# Altium schematic sheet Power Supply.SchDoc (part 2 of 5)
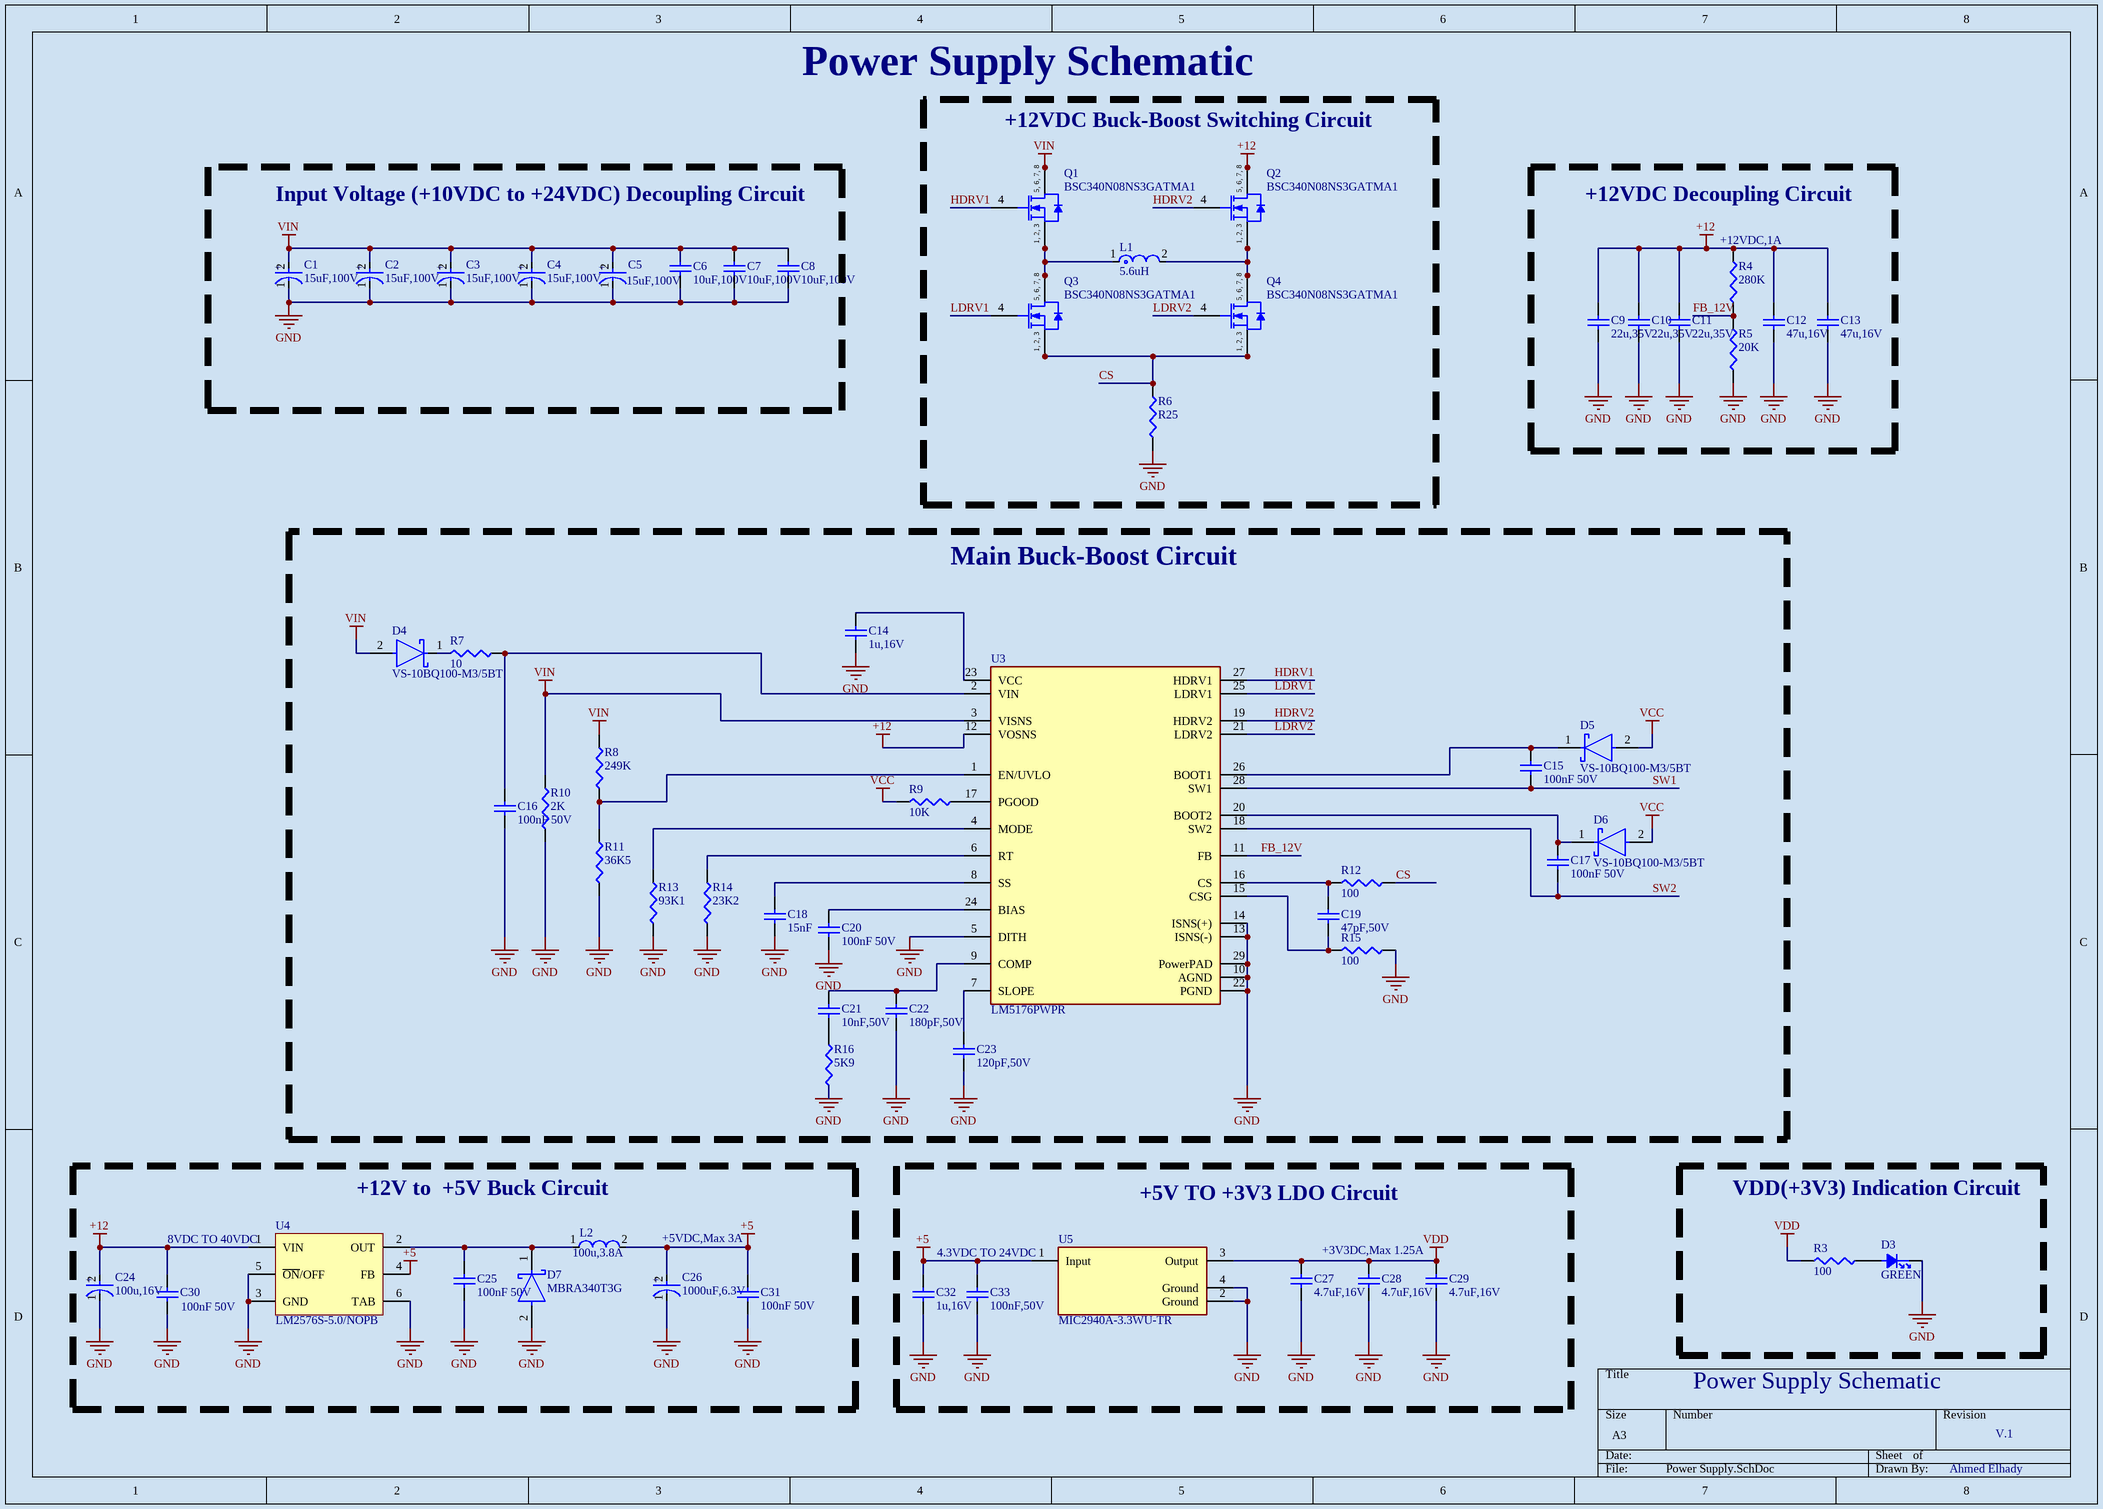
[diagram p1: Power Supply.SchDoc]
## Library data of the parts
C1-C5 = 100SXV15M: 15 µF 100 V Aluminum - Polymer Capacitors Radial, Can - SMD 40mOhm 1000 Hrs @ 125°C; Manufacturer: Panasonic; Value: 15µF; ESR (Equivalent Series Resistance): 40mΩ; Leakage Current: 75µA; Life (Hours): 1000hours; Polarity: Polar; Ripple Current: 36.5mA; Tolerance: 20%; Supplier: DigiKey; Manufacturer Part Number: 100SXV15M; RoHS: Compliant; Category: Aluminum Electrolytic Capacitors; Pricing: 1=3.23, 10=2.172, 50=1.7306, 100=1.5916 (USD); Case/Package: Radial; Diameter: 8mm; Height: 11.9mm; Height - Seated (Max): 11.9888mm; Length: 8.3mm; Lifecycle Status: Production; Material: Polymer; Max Operating Temperature: 125°C; Min Operating Temperature: -55°C; Mounting Technology: Surface Mount; Number of Terminals: 2; REACH SVHC: Yes; Schedule B: 8532220020, 8532220020|8532220020|8532220020|8532220020|8532220020|8532220020|8532220020|8532220020|8532220020|8532220020|8532220020|8532220020|8532220020|8532220020|8532220020|8532220020|8532220020|8532220020|8532220020|8532220020|8532220020|8532220020|8532220020|85; Voltage Rating: 100V; Voltage Rating (DC): 100V; Width: 8.3mm; ComponentLink1URL: https://datasheet.octopart.com:443/100SXV15M-Panasonic-datasheet-182100634.pdf?src-supplier=IHS; ComponentLink1Description: https://datasheet.octopart.com:443/100SXV15M-Panasonic-datasheet-182100634.pdf?src-supplier=IHS; ComponentLink2URL: https://sigma.octopart.com:443/138897373/technical_drawing/Panasonic-100SXV15M.pdf?src-supplier=Upverter; ComponentLink2Description: https://sigma.octopart.com:443/138897373/technical_drawing/Panasonic-100SXV15M.pdf?src-supplier=Upverter; ComponentLink3URL: https://datasheet.octopart.com:443/100SXV15M-Panasonic-datasheet-136807604.pdf?src-supplier=Master+Electronics; ComponentLink3Description: https://datasheet.octopart.com:443/100SXV15M-Panasonic-datasheet-136807604.pdf?src-supplier=Master+Electronics; ComponentLink4URL: https://datasheet.octopart.com:443/100SXV15M-Panasonic-datasheet-137287090.pdf?src-supplier=Master+Electronics; ComponentLink4Description: https://datasheet.octopart.com:443/100SXV15M-Panasonic-datasheet-137287090.pdf?src-supplier=Master+Electronics; ComponentLink5URL: https://datasheet.octopart.com:443/100SXV15M-Panasonic-datasheet-98225043.pdf?src-supplier=Farnell; ComponentLink5Description: https://datasheet.octopart.com:443/100SXV15M-Panasonic-datasheet-98225043.pdf?src-supplier=Farnell; ComponentLink6URL: https://datasheet.octopart.com:443/100SXV15M-Panasonic-datasheet-46913357.pdf?src-supplier=Newark; ComponentLink6Description: https://datasheet.octopart.com:443/100SXV15M-Panasonic-datasheet-46913357.pdf?src-supplier=Newark; ComponentLink7URL: https://datasheet.octopart.com:443/100SXV15M-Panasonic-datasheet-84207363.pdf?src-supplier=Panasonic+SCT; ComponentLink7Description: https://datasheet.octopart.com:443/100SXV15M-Panasonic-datasheet-84207363.pdf?src-supplier=Panasonic+SCT; ComponentLink8URL: https://sigma.octopart.com:443/150570690/technical_drawing/Panasonic-100SXV15M.pdf?src-supplier=Panasonic+SCT; ComponentLink8Description: https://sigma.octopart.com:443/150570690/technical_drawing/Panasonic-100SXV15M.pdf?src-supplier=Panasonic+SCT; ComponentLink9URL: https://datasheet.octopart.com:443/100SXV15M-Panasonic-datasheet-78862147.pdf?src-supplier=element14+APAC; ComponentLink9Description: https://datasheet.octopart.com:443/100SXV15M-Panasonic-datasheet-78862147.pdf?src-supplier=element14+APAC; LCSC PN: C542593
C6-C8 = C3225X7R2A106K250AC: 10 µF ±10% 100V Ceramic Capacitor X7R 1210 (3225 Metric); Manufacturer: TDK; Manufacturer Lifecycle Status: PRODUCTION; Value: 10µF; Supplier: DigiKey; Manufacturer Part Number: C3225X7R2A106K250AC; RoHS: Compliant; Category: Ceramic Capacitors; Stock: 64436; Pricing: 1=1.48, 10=0.943, 50=0.7756, 100=0.7141, 500=0.6104 (USD); Case/Package: 1210; China RoHS: Compliant; Dielectric Material: Ceramic; Height: 2.5mm; Length: 3.2mm; Lifecycle Status: Production; Material: Ceramic; Max Length: 3.65mm; Max Operating Temperature: 125°C; Max Width: 2.85mm; Min Length: 2.8mm; Min Operating Temperature: -55°C; Min Width: 2.2mm; Mounting Technology: Surface Mount; Number of Terminals: 2; REACH SVHC: Yes; Tolerance: 10%; Voltage Rating: 100V; Voltage Rating (DC): 100V; Width: 2.5mm; ComponentLink1URL: https://datasheet.octopart.com:443/C3225X7R2A106K250AC-TDK-datasheet-182135092.pdf?src-supplier=IHS; ComponentLink1Description: https://datasheet.octopart.com:443/C3225X7R2A106K250AC-TDK-datasheet-182135092.pdf?src-supplier=IHS; ComponentLink2URL: https://datasheet.octopart.com:443/C3225X7R2A106K250AC-TDK-datasheet-151546522.pdf?src-supplier=Future+Electronics; ComponentLink2Description: https://datasheet.octopart.com:443/C3225X7R2A106K250AC-TDK-datasheet-151546522.pdf?src-supplier=Future+Electronics; ComponentLink3URL: https://datasheet.octopart.com:443/C3225X7R2A106K250AC-TDK-datasheet-151546523.pdf?src-supplier=ODG+(Origin+Data+Global); ComponentLink3Description: https://datasheet.octopart.com:443/C3225X7R2A106K250AC-TDK-datasheet-151546523.pdf?src-supplier=ODG+(Origin+Data+Global); LCSC PN: C3883958
C9-C11 = C2012X5R1V226M125AC: 22 µF ±20% 35V Ceramic Capacitor X5R 0805 (2012 Metric); Manufacturer: TDK; Manufacturer Lifecycle Status: PRODUCTION; Value: 22µF; Supplier: DigiKey; Manufacturer Part Number: C2012X5R1V226M125AC; RoHS: Compliant; Category: Ceramic Capacitors; Stock: 844067; Pricing: 1=0.57, 10=0.349, 50=0.263, 100=0.2367, 500=0.1923, 1000=0.17857 (USD); Case/Package: 0805; Case Code (Imperial): 0805; Case Code (Metric): 2012; China RoHS: Compliant; Dielectric: X5R; Dielectric Material: Ceramic; Height: 1.25mm; Lead Free: Lead Free; Length: 2mm; Lifecycle Status: Production; Material: Ceramic; Max Length: 2.2mm; Max Operating Temperature: 85°C; Max Width: 1.45mm; Min Length: 1.8mm; Min Operating Temperature: -55°C; Min Width: 1.05mm; Mounting Technology: Surface Mount; Number of Terminals: 2; REACH SVHC: Yes; Schedule B: 8532240020, 8532240020|8532240020|8532240020|8532240020|8532240020; Termination: SMD/SMT; Tolerance: 20%; Voltage Rating: 35V; Voltage Rating (DC): 35V; Weight: 5.499807mg; Width: 1.25mm; ComponentLink1URL: https://datasheet.octopart.com:443/C2012X5R1V226M125AC-TDK-datasheet-175423548.pdf?src-supplier=TME; ComponentLink1Description: https://datasheet.octopart.com:443/C2012X5R1V226M125AC-TDK-datasheet-175423548.pdf?src-supplier=TME; ComponentLink2URL: https://datasheet.octopart.com:443/C2012X5R1V226M125AC-TDK-datasheet-182135025.pdf?src-supplier=TME; ComponentLink2Description: https://datasheet.octopart.com:443/C2012X5R1V226M125AC-TDK-datasheet-182135025.pdf?src-supplier=TME; ComponentLink3URL: https://datasheet.octopart.com:443/C2012X5R1V226M125AC-TDK-datasheet-159617022.pdf?src-supplier=TME; ComponentLink3Description: https://datasheet.octopart.com:443/C2012X5R1V226M125AC-TDK-datasheet-159617022.pdf?src-supplier=TME; ComponentLink4URL: https://datasheet.octopart.com:443/C2012X5R1V226M125AC-TDK-datasheet-68298673.pdf?src-supplier=Upverter; ComponentLink4Description: https://datasheet.octopart.com:443/C2012X5R1V226M125AC-TDK-datasheet-68298673.pdf?src-supplier=Upverter; ComponentLink5URL: https://datasheet.octopart.com:443/C2012X5R1V226M125AC-TDK-datasheet-151546523.pdf?src-supplier=ODG+(Origin+Data+Global); ComponentLink5Description: https://datasheet.octopart.com:443/C2012X5R1V226M125AC-TDK-datasheet-151546523.pdf?src-supplier=ODG+(Origin+Data+Global); ComponentLink6URL: https://datasheet.octopart.com:443/C2012X5R1V226M125AC-TDK-datasheet-82475248.pdf?src-supplier=Newark; ComponentLink6Description: https://datasheet.octopart.com:443/C2012X5R1V226M125AC-TDK-datasheet-82475248.pdf?src-supplier=Newark; ComponentLink7URL: https://datasheet.octopart.com/C2012X5R1V226M125AC-TDK-datasheet-41194876.pdf; ComponentLink7Description: https://datasheet.octopart.com/C2012X5R1V226M125AC-TDK-datasheet-41194876.pdf; ComponentLink8URL: https://datasheet.octopart.com/C-Series-Ceramic-Chip-Capacitors-TDK-datasheet-family-84.pdf; ComponentLink8Description: https://datasheet.octopart.com/C-Series-Ceramic-Chip-Capacitors-TDK-datasheet-family-84.pdf; ComponentLink9URL: https://datasheet.octopart.com:443/C2012X5R1V226M125AC-TDK-datasheet-158983655.pdf?src-supplier=Farnell; ComponentLink9Description: https://datasheet.octopart.com:443/C2012X5R1V226M125AC-TDK-datasheet-158983655.pdf?src-supplier=Farnell; ComponentLink10URL: https://datasheet.octopart.com:443/C2012X5R1V226M125AC-TDK-datasheet-25352837.pdf?src-supplier=Future+Electronics; ComponentLink10Description: https://datasheet.octopart.com:443/C2012X5R1V226M125AC-TDK-datasheet-25352837.pdf?src-supplier=Future+Electronics; ComponentLink11URL: https://datasheet.octopart.com:443/C2012X5R1V226M125AC-TDK-datasheet-23766614.pdf?src-supplier=Future+Electronics; ComponentLink11Description: https://datasheet.octopart.com:443/C2012X5R1V226M125AC-TDK-datasheet-23766614.pdf?src-supplier=Future+Electronics; ComponentLink12URL: http://sigma.octopart.com:80/rohs_certificate/C-Series-Ceramic-Chip-Capacitors-TDK-family-108.pdf?src-supplier=Compliance+Statements; ComponentLink12Description: http://sigma.octopart.com:80/rohs_certificate/C-Series-Ceramic-Chip-Capacitors-TDK-family-108.pdf?src-supplier=Compliance+Statements; LCSC PN: C2179409
C12 C13 = GRM32ER61C476KE15L: 47 µF ±10% 16V Ceramic Capacitor X5R 1210 (3225 Metric); Manufacturer: Murata; Manufacturer Lifecycle Status: NRND; Value: 47µF; Supplier: DigiKey; Manufacturer Part Number: GRM32ER61C476KE15L; RoHS: Compliant; Category: Ceramic Capacitors; Stock: 76946; Pricing: 1=1.23, 10=0.798, 50=0.6284, 100=0.5762, 500=0.48794, 1000=0.46985, 2000=0.44694, 3000=0.43546, 5000=0.42273, 7000=0.41529, 10000=0.40814, 12000=0.40475, 24000=0.39332, 25000=0.39272 (USD); Case/Package: 1210; Case Code (Imperial): 1210; Case Code (Metric): 3225; Depth: 2.5mm; Dielectric: X5R; Dielectric Material: Ceramic; Height: 2.5mm; Lead Free: Lead Free; Length: 3.2mm; Lifecycle Status: NRND; Material: Ceramic; Max Operating Temperature: 85°C; Min Operating Temperature: -55°C; Mounting Technology: Surface Mount; Pins: 2; Number of Terminals: 2; Radiation Hardening: No; REACH SVHC: Yes; Schedule B: 8532240020, 8532240020|8532240020, 8532240020|8532240020|8532240020, 8532240020|8532240020|8532240020|8532240020; Termination: SMD/SMT; Thickness: 2.5mm; Tolerance: 10%; Voltage: 16V; Voltage Rating: 16V; Voltage Rating (DC): 16V; Width: 2.5mm; ComponentLink1URL: https://datasheet.octopart.com:443/GRM32ER61C476KE15L-Murata-datasheet-11893327.pdf?src-supplier=_legacy+Avnet; ComponentLink1Description: https://datasheet.octopart.com:443/GRM32ER61C476KE15L-Murata-datasheet-11893327.pdf?src-supplier=_legacy+Avnet; ComponentLink2URL: https://datasheet.octopart.com:443/GRM32ER61C476KE15L-Murata-datasheet-62317406.pdf?src-supplier=element14+APAC; ComponentLink2Description: https://datasheet.octopart.com:443/GRM32ER61C476KE15L-Murata-datasheet-62317406.pdf?src-supplier=element14+APAC; ComponentLink3URL: https://datasheet.octopart.com:443/GRM32ER61C476KE15L-Murata-datasheet-17853190.pdf?src-supplier=element14+APAC; ComponentLink3Description: https://datasheet.octopart.com:443/GRM32ER61C476KE15L-Murata-datasheet-17853190.pdf?src-supplier=element14+APAC; ComponentLink4URL: https://datasheet.octopart.com:443/GRM32ER61C476KE15L-Murata-datasheet-8817987.pdf?src-supplier=Newark; ComponentLink4Description: https://datasheet.octopart.com:443/GRM32ER61C476KE15L-Murata-datasheet-8817987.pdf?src-supplier=Newark; ComponentLink5URL: https://datasheet.octopart.com:443/GRM32ER61C476KE15L-Murata-datasheet-14403028.pdf?src-supplier=Future+Electronics; ComponentLink5Description: https://datasheet.octopart.com:443/GRM32ER61C476KE15L-Murata-datasheet-14403028.pdf?src-supplier=Future+Electronics; ComponentLink6URL: https://datasheet.octopart.com:443/GRM32ER61C476KE15L-Murata-datasheet-22122223.pdf?src-supplier=Future+Electronics; ComponentLink6Description: https://datasheet.octopart.com:443/GRM32ER61C476KE15L-Murata-datasheet-22122223.pdf?src-supplier=Future+Electronics; ComponentLink7URL: https://datasheet.octopart.com:443/GRM32ER61C476KE15L-Murata-datasheet-44109711.pdf?src-supplier=Future+Electronics; ComponentLink7Description: https://datasheet.octopart.com:443/GRM32ER61C476KE15L-Murata-datasheet-44109711.pdf?src-supplier=Future+Electronics; ComponentLink8URL: https://datasheet.octopart.com:443/GRM32ER61C476KE15L-Murata-datasheet-165579666.pdf?src-supplier=TME; ComponentLink8Description: https://datasheet.octopart.com:443/GRM32ER61C476KE15L-Murata-datasheet-165579666.pdf?src-supplier=TME; ComponentLink9URL: https://datasheet.octopart.com:443/GRM32ER61C476KE15L-Murata-datasheet-59876780.pdf?src-supplier=TME; ComponentLink9Description: https://datasheet.octopart.com:443/GRM32ER61C476KE15L-Murata-datasheet-59876780.pdf?src-supplier=TME; ComponentLink10URL: https://datasheet.octopart.com:443/GRM32ER61C476KE15L-Murata-datasheet-140709622.pdf?src-supplier=Ciiva; ComponentLink10Description: https://datasheet.octopart.com:443/GRM32ER61C476KE15L-Murata-datasheet-140709622.pdf?src-supplier=Ciiva; ComponentLink11URL: https://datasheet.octopart.com:443/GRM32ER61C476KE15L-Murata-datasheet-138747025.pdf?src-supplier=Ciiva; ComponentLink11Description: https://datasheet.octopart.com:443/GRM32ER61C476KE15L-Murata-datasheet-138747025.pdf?src-supplier=Ciiva; ComponentLink12URL: https://datasheet.octopart.com:443/GRM32ER61C476KE15L-Murata-datasheet-14047368.pdf?src-supplier=iiiC; ComponentLink12Description: https://datasheet.octopart.com:443/GRM32ER61C476KE15L-Murata-datasheet-14047368.pdf?src-supplier=iiiC; ComponentLink13URL: https://datasheet.octopart.com/GRM32ER61C476KE15L-Murata-datasheet-12515295.pdf; ComponentLink13Description: https://datasheet.octopart.com/GRM32ER61C476KE15L-Murata-datasheet-12515295.pdf; ComponentLink14URL: https://datasheet.octopart.com/GRM32ER61C476KE15L-Murata-datasheet-12510076.pdf; ComponentLink14Description: https://datasheet.octopart.com/GRM32ER61C476KE15L-Murata-datasheet-12510076.pdf; ComponentLink15URL: https://datasheet.octopart.com/GRM32ER61C476KE15L-Murata-datasheet-11978611.pdf; ComponentLink15Description: https://datasheet.octopart.com/GRM32ER61C476KE15L-Murata-datasheet-11978611.pdf; ComponentLink16URL: https://datasheet.octopart.com/GRM32ER61C476KE15L-Murata-datasheet-10025737.pdf; ComponentLink16Description: https://datasheet.octopart.com/GRM32ER61C476KE15L-Murata-datasheet-10025737.pdf; ComponentLink17URL: https://datasheet.octopart.com/GRM32ER61C476KE15L-Murata-datasheet-8819587.pdf; ComponentLink17Description: https://datasheet.octopart.com/GRM32ER61C476KE15L-Murata-datasheet-8819587.pdf; ComponentLink18URL: https://datasheet.octopart.com:443/GRM32ER61C476KE15L.-Murata-datasheet-5332913.pdf?src-supplier=Farnell; ComponentLink18Description: https://datasheet.octopart.com:443/GRM32ER61C476KE15L.-Murata-datasheet-5332913.pdf?src-supplier=Farnell; ComponentLink19URL: http://sigma.octopart.com:80/reach_statement/Murata-company-16.pdf?src-supplier=Compliance+Statements; ComponentLink19Description: http://sigma.octopart.com:80/reach_statement/Murata-company-16.pdf?src-supplier=Compliance+Statements; LCSC PN: C77101
C14 C32 = EMK107B7105KA-T: 1 µF ±10% 16V Ceramic Capacitor X7R 0603 (1608 Metric); Manufacturer: Taiyo Yuden; Value: 1µF; Supplier: DigiKey; Manufacturer Part Number: EMK107B7105KA-T; RoHS: Compliant; Category: Ceramic Capacitors; Stock: 1003655; Pricing: 1=0.08, 10=0.013, 50=0.0116, 100=0.0104, 500=0.00964 (USD); Case/Package: 0603; Case Code (Imperial): 0603; Case Code (Metric): 1608; China RoHS: Compliant; Composition: Ceramic; Contact Plating: Nickel; Depth: 800µm; Dielectric: X7R; Dielectric Material: Ceramic; Halogen Free: Halogen Free; Height: 800µm; Lead Free: Lead Free; Length: 1.6mm; Lifecycle Status: Production; Material: Ceramic; Max Length: 1.7mm; Max Operating Temperature: 125°C; Max Thickness: 900µm; Max Width: 900µm; Min Length: 1.5mm; Min Operating Temperature: -55°C; Min Thickness: 700µm; Min Width: 700µm; Mounting Technology: Surface Mount; Pins: 2; Number of Terminals: 2; Packaging: Cut Tape; Radiation Hardening: No; REACH SVHC: Yes; Termination: SMD/SMT; Thickness: 889µm; Tolerance: 10%; Voltage Rating: 16V; Voltage Rating (DC): 16V; Width: 800µm; ComponentLink1URL: https://datasheet.octopart.com:443/EMK107B7105KA-T-Taiyo-Yuden-datasheet-182102775.pdf?src-supplier=IHS; ComponentLink1Description: https://datasheet.octopart.com:443/EMK107B7105KA-T-Taiyo-Yuden-datasheet-182102775.pdf?src-supplier=IHS; ComponentLink2URL: https://datasheet.octopart.com:443/EMK107B7105KA-T-Taiyo-Yuden-datasheet-8857305.pdf?src-supplier=Master+Electronics; ComponentLink2Description: https://datasheet.octopart.com:443/EMK107B7105KA-T-Taiyo-Yuden-datasheet-8857305.pdf?src-supplier=Master+Electronics; ComponentLink3URL: https://datasheet.octopart.com:443/EMK107B7105KA-T-Taiyo-Yuden-datasheet-154807686.pdf?src-supplier=Master+Electronics; ComponentLink3Description: https://datasheet.octopart.com:443/EMK107B7105KA-T-Taiyo-Yuden-datasheet-154807686.pdf?src-supplier=Master+Electronics; ComponentLink4URL: https://datasheet.octopart.com:443/EMK107B7105KA-T-Taiyo-Yuden-datasheet-140424376.pdf?src-supplier=Master+Electronics; ComponentLink4Description: https://datasheet.octopart.com:443/EMK107B7105KA-T-Taiyo-Yuden-datasheet-140424376.pdf?src-supplier=Master+Electronics; ComponentLink5URL: https://datasheet.octopart.com:443/EMK107B7105KA-T-Taiyo-Yuden-datasheet-151625811.pdf?src-supplier=Farnell; ComponentLink5Description: https://datasheet.octopart.com:443/EMK107B7105KA-T-Taiyo-Yuden-datasheet-151625811.pdf?src-supplier=Farnell; ComponentLink6URL: https://datasheet.octopart.com:443/EMK107B7105KA-T-Taiyo-Yuden-datasheet-65850851.pdf?src-supplier=Newark; ComponentLink6Description: https://datasheet.octopart.com:443/EMK107B7105KA-T-Taiyo-Yuden-datasheet-65850851.pdf?src-supplier=Newark; ComponentLink7URL: https://datasheet.octopart.com:443/EMK107B7105KA-T-Taiyo-Yuden-datasheet-14717454.pdf?src-supplier=Newark; ComponentLink7Description: https://datasheet.octopart.com:443/EMK107B7105KA-T-Taiyo-Yuden-datasheet-14717454.pdf?src-supplier=Newark; ComponentLink8URL: https://datasheet.octopart.com:443/EMK107B7105KA-T-Taiyo-Yuden-datasheet-138738940.pdf?src-supplier=Taiyo+Yuden+SCT; ComponentLink8Description: https://datasheet.octopart.com:443/EMK107B7105KA-T-Taiyo-Yuden-datasheet-138738940.pdf?src-supplier=Taiyo+Yuden+SCT; ComponentLink9URL: https://datasheet.octopart.com:443/EMK107B7105KA-T-Taiyo-Yuden-datasheet-99784766.pdf?src-supplier=Future+Electronics; ComponentLink9Description: https://datasheet.octopart.com:443/EMK107B7105KA-T-Taiyo-Yuden-datasheet-99784766.pdf?src-supplier=Future+Electronics; ComponentLink10URL: https://datasheet.octopart.com:443/EMK107B7105KA-T-Taiyo-Yuden-datasheet-99833418.pdf?src-supplier=Future+Electronics; ComponentLink10Description: https://datasheet.octopart.com:443/EMK107B7105KA-T-Taiyo-Yuden-datasheet-99833418.pdf?src-supplier=Future+Electronics; ComponentLink11URL: https://datasheet.octopart.com:443/CEEMK107B7105KA-T-Taiyo-Yuden-datasheet-62282700.pdf?src-supplier=Electro+Sonic; ComponentLink11Description: https://datasheet.octopart.com:443/CEEMK107B7105KA-T-Taiyo-Yuden-datasheet-62282700.pdf?src-supplier=Electro+Sonic; ComponentLink12URL: https://datasheet.octopart.com:443/EMK107B7105KA-T-Taiyo-Yuden-datasheet-62109223.pdf?src-supplier=Electro+Sonic; ComponentLink12Description: https://datasheet.octopart.com:443/EMK107B7105KA-T-Taiyo-Yuden-datasheet-62109223.pdf?src-supplier=Electro+Sonic; ComponentLink13URL: https://datasheet.octopart.com:443/EMK107B7105KA-T-Taiyo-Yuden-datasheet-41181424.pdf?src-supplier=Electro+Sonic; ComponentLink13Description: https://datasheet.octopart.com:443/EMK107B7105KA-T-Taiyo-Yuden-datasheet-41181424.pdf?src-supplier=Electro+Sonic; ComponentLink14URL: https://datasheet.octopart.com/EMK107B7105KA-T-Taiyo-Yuden-datasheet-17272276.pdf; ComponentLink14Description: https://datasheet.octopart.com/EMK107B7105KA-T-Taiyo-Yuden-datasheet-17272276.pdf; ComponentLink15URL: https://datasheet.octopart.com:443/EMK107B7105KA-T-Taiyo-Yuden-datasheet-13693549.pdf?src-supplier=_legacy+Avnet; ComponentLink15Description: https://datasheet.octopart.com:443/EMK107B7105KA-T-Taiyo-Yuden-datasheet-13693549.pdf?src-supplier=_legacy+Avnet; ComponentLink16URL: https://datasheet.octopart.com:443/EMK107B7105KA-T-Taiyo-Yuden-datasheet-10851928.pdf?src-supplier=element14; ComponentLink16Description: https://datasheet.octopart.com:443/EMK107B7105KA-T-Taiyo-Yuden-datasheet-10851928.pdf?src-supplier=element14; ComponentLink17URL: https://datasheet.octopart.com:443/EMK107B7105KA-T-Taiyo-Yuden-datasheet-8434558.pdf?src-supplier=element14; ComponentLink17Description: https://datasheet.octopart.com:443/EMK107B7105KA-T-Taiyo-Yuden-datasheet-8434558.pdf?src-supplier=element14; ComponentLink18URL: https://datasheet.octopart.com:443/EMK107B7105KA-T-Taiyo-Yuden-datasheet-10742123.pdf?src-supplier=Factory+Futures; ComponentLink18Description: https://datasheet.octopart.com:443/EMK107B7105KA-T-Taiyo-Yuden-datasheet-10742123.pdf?src-supplier=Factory+Futures; LCSC PN: C92759
C15-C17 C20 C25 C30 C31 C33 = CGA3E2X7R1H104K080AA: 0.1 µF ±10% 50V Ceramic Capacitor X7R 0603 (1608 Metric); Manufacturer: TDK; Manufacturer Lifecycle Status: PRODUCTION; Supplier: DigiKey; Manufacturer Part Number: CGA3E2X7R1H104K080AA; RoHS: Compliant; Category: Ceramic Capacitors; Stock: 973492; Pricing: 1=0.1, 10=0.044, 50=0.0302, 100=0.026, 500=0.01886, 1000=0.01666 (USD); Value: 100nF; Case/Package: 0603; Case Code (Imperial): 0603; Case Code (Metric): 1608; China RoHS: Compliant; Composition: Ceramic; Depth: 800µm; Dielectric: X7R; Dielectric Material: Ceramic; Height: 800µm; Lead Free: Lead Free; Length: 1.6mm; Lifecycle Status: Production; Material: Ceramic; Max Length: 1.7mm; Max Operating Temperature: 125°C; Max Width: 900µm; Min Length: 1.5mm; Min Operating Temperature: -55°C; Min Width: 700µm; Mounting Technology: Surface Mount; Number of Terminals: 2; Radiation Hardening: No; Ratings: AEC-Q200; REACH SVHC: Yes; Schedule B: 8532240020, 8532240020|8532240020|8532240020|8532240020|8532240020; Termination: SMD/SMT; Thickness: 889µm; Tolerance: 10%; Voltage: 50V; Voltage Rating: 50V; Voltage Rating (DC): 50V; Weight: 2.012816mg; Width: 800µm; ComponentLink1URL: https://datasheet.octopart.com:443/CGA3E2X7R1H104K080AA-TDK-datasheet-165583812.pdf?src-supplier=IHS; ComponentLink1Description: https://datasheet.octopart.com:443/CGA3E2X7R1H104K080AA-TDK-datasheet-165583812.pdf?src-supplier=IHS; ComponentLink2URL: https://datasheet.octopart.com:443/CGA3E2X7R1H104K080AA-TDK-datasheet-138890726.pdf?src-supplier=Upverter; ComponentLink2Description: https://datasheet.octopart.com:443/CGA3E2X7R1H104K080AA-TDK-datasheet-138890726.pdf?src-supplier=Upverter; ComponentLink3URL: https://datasheet.octopart.com:443/CGA3E2X7R1H104K080AA-TDK-datasheet-43457115.pdf?src-supplier=Upverter; ComponentLink3Description: https://datasheet.octopart.com:443/CGA3E2X7R1H104K080AA-TDK-datasheet-43457115.pdf?src-supplier=Upverter; ComponentLink4URL: https://datasheet.octopart.com:443/CGA3E2X7R1H104K080AA-TDK-datasheet-151546526.pdf?src-supplier=ODG+(Origin+Data+Global); ComponentLink4Description: https://datasheet.octopart.com:443/CGA3E2X7R1H104K080AA-TDK-datasheet-151546526.pdf?src-supplier=ODG+(Origin+Data+Global); ComponentLink5URL: https://datasheet.octopart.com:443/CGA3E2X7R1H104K080AA-TDK-datasheet-43366117.pdf?src-supplier=Newark; ComponentLink5Description: https://datasheet.octopart.com:443/CGA3E2X7R1H104K080AA-TDK-datasheet-43366117.pdf?src-supplier=Newark; ComponentLink6URL: https://datasheet.octopart.com:443/CGA3E2X7R1H104K080AA-TDK-datasheet-23766614.pdf?src-supplier=Newark; ComponentLink6Description: https://datasheet.octopart.com:443/CGA3E2X7R1H104K080AA-TDK-datasheet-23766614.pdf?src-supplier=Newark; ComponentLink7URL: https://datasheet.octopart.com:443/CGA3E2X7R1H104K080AA-TDK-datasheet-13444418.pdf?src-supplier=Newark; ComponentLink7Description: https://datasheet.octopart.com:443/CGA3E2X7R1H104K080AA-TDK-datasheet-13444418.pdf?src-supplier=Newark; ComponentLink8URL: https://datasheet.octopart.com:443/CGA3E2X7R1H104K080AA.-TDK-datasheet-159510193.pdf?src-supplier=Newark; ComponentLink8Description: https://datasheet.octopart.com:443/CGA3E2X7R1H104K080AA.-TDK-datasheet-159510193.pdf?src-supplier=Newark; ComponentLink9URL: https://datasheet.octopart.com:443/CGA3E2X7R1H104K080AA-TDK-datasheet-136412745.pdf?src-supplier=element14+APAC; ComponentLink9Description: https://datasheet.octopart.com:443/CGA3E2X7R1H104K080AA-TDK-datasheet-136412745.pdf?src-supplier=element14+APAC; ComponentLink10URL: https://datasheet.octopart.com:443/CGA3E2X7R1H104K080AA-TDK-datasheet-21217900.pdf?src-supplier=Farnell; ComponentLink10Description: https://datasheet.octopart.com:443/CGA3E2X7R1H104K080AA-TDK-datasheet-21217900.pdf?src-supplier=Farnell; ComponentLink11URL: https://datasheet.octopart.com:443/CGA3E2X7R1H104K080AA-TDK-datasheet-164882302.pdf?src-supplier=Burklin+Elektronik; ComponentLink11Description: https://datasheet.octopart.com:443/CGA3E2X7R1H104K080AA-TDK-datasheet-164882302.pdf?src-supplier=Burklin+Elektronik; ComponentLink12URL: https://datasheet.octopart.com:443/CGA3E2X7R1H104K080AA-TDK-datasheet-13234200.pdf?src-supplier=Future+Electronics; ComponentLink12Description: https://datasheet.octopart.com:443/CGA3E2X7R1H104K080AA-TDK-datasheet-13234200.pdf?src-supplier=Future+Electronics; ComponentLink13URL: https://datasheet.octopart.com:443/CGA3E2X7R1H104K080AA-TDK-datasheet-12527010.pdf?src-supplier=Future+Electronics; ComponentLink13Description: https://datasheet.octopart.com:443/CGA3E2X7R1H104K080AA-TDK-datasheet-12527010.pdf?src-supplier=Future+Electronics; ComponentLink14URL: https://datasheet.octopart.com:443/CGA3E2X7R1H104K080AA-TDK-datasheet-140571036.pdf?src-supplier=Arrow.cn; ComponentLink14Description: https://datasheet.octopart.com:443/CGA3E2X7R1H104K080AA-TDK-datasheet-140571036.pdf?src-supplier=Arrow.cn; LCSC PN: C189228
C18 = C0603C153J3GACTU: 15nF ±5% 25V Ceramic Capacitor C0G, NP0 0603 (1608 Metric); Manufacturer: KEMET; Dissipation Factor: 0.1%; Temperature Coefficient: 30ppm/°C; Supplier: DigiKey; Manufacturer Part Number: C0603C153J3GACTU; RoHS: Compliant; Category: Ceramic Capacitors; Stock: 20065; Pricing: 1=0.37, 10=0.221, 50=0.163, 100=0.1376, 500=0.10484, 1000=0.0951 (USD); Value: 15nF; Case/Package: 0603; Case Code (Imperial): 0603; Case Code (Metric): 1608; China RoHS: Compliant; Contact Plating: Tin; Depth: 800µm; Dielectric: C0G; Dielectric Material: Ceramic; Height: 800µm; Lead Free: Lead Free; Length: 1.6mm; Lifecycle Status: Production; Material: Ceramic; Max Operating Temperature: 125°C; Min Operating Temperature: -55°C; Mounting Technology: Surface Mount; Pins: 2; Number of Terminals: 2; Packaging: Cut Tape; REACH SVHC: Yes; Schedule B: 8532240020, 8532240020|8532240020, 8532240020|8532240020|8532240020, 8532240020|8532240020|8532240020|8532240020; Termination: SMD/SMT; Thickness: 863.6µm; Tolerance: 5%; Voltage: 25V; Voltage Rating: 25V; Voltage Rating (DC): 25V; Width: 800µm; ComponentLink1URL: https://datasheet.octopart.com:443/C0603C153J3GACTU-KEMET-datasheet-178132257.pdf?src-supplier=IHS; ComponentLink1Description: https://datasheet.octopart.com:443/C0603C153J3GACTU-KEMET-datasheet-178132257.pdf?src-supplier=IHS; ComponentLink2URL: https://datasheet.octopart.com:443/C0603C153J3GAC7867-KEMET-datasheet-10540709.pdf?src-supplier=IHS; ComponentLink2Description: https://datasheet.octopart.com:443/C0603C153J3GAC7867-KEMET-datasheet-10540709.pdf?src-supplier=IHS; ComponentLink3URL: https://datasheet.octopart.com:443/C0603C153J3GACTU-KEMET-datasheet-137357764.pdf?src-supplier=Upverter; ComponentLink3Description: https://datasheet.octopart.com:443/C0603C153J3GACTU-KEMET-datasheet-137357764.pdf?src-supplier=Upverter; ComponentLink4URL: https://datasheet.octopart.com:443/C0603C153J3GACTU-KEMET-datasheet-68331921.pdf?src-supplier=Farnell; ComponentLink4Description: https://datasheet.octopart.com:443/C0603C153J3GACTU-KEMET-datasheet-68331921.pdf?src-supplier=Farnell; ComponentLink5URL: https://datasheet.octopart.com:443/C0603C153J3GACTU-KEMET-datasheet-102648314.pdf?src-supplier=Farnell; ComponentLink5Description: https://datasheet.octopart.com:443/C0603C153J3GACTU-KEMET-datasheet-102648314.pdf?src-supplier=Farnell; ComponentLink6URL: https://datasheet.octopart.com:443/C0603C153J3GACTU-Kemet-datasheet-5308203.pdf?src-supplier=Farnell; ComponentLink6Description: https://datasheet.octopart.com:443/C0603C153J3GACTU-Kemet-datasheet-5308203.pdf?src-supplier=Farnell; ComponentLink7URL: https://datasheet.octopart.com:443/C0603C153J3GACTU-KEMET-datasheet-176289261.pdf?src-supplier=element14+APAC; ComponentLink7Description: https://datasheet.octopart.com:443/C0603C153J3GACTU-KEMET-datasheet-176289261.pdf?src-supplier=element14+APAC; ComponentLink8URL: https://datasheet.octopart.com:443/C0603C153J3GACTU-KEMET-datasheet-178087916.pdf?src-supplier=element14+APAC; ComponentLink8Description: https://datasheet.octopart.com:443/C0603C153J3GACTU-KEMET-datasheet-178087916.pdf?src-supplier=element14+APAC; ComponentLink9URL: https://datasheet.octopart.com:443/C0603C153J3GACTU-Kemet-datasheet-66093294.pdf?src-supplier=element14+APAC; ComponentLink9Description: https://datasheet.octopart.com:443/C0603C153J3GACTU-Kemet-datasheet-66093294.pdf?src-supplier=element14+APAC; ComponentLink10URL: https://datasheet.octopart.com:443/C0603C153J3GACTU-Kemet-datasheet-66634713.pdf?src-supplier=element14+APAC; ComponentLink10Description: https://datasheet.octopart.com:443/C0603C153J3GACTU-Kemet-datasheet-66634713.pdf?src-supplier=element14+APAC; ComponentLink11URL: https://datasheet.octopart.com:443/C0603C153J3GACTU-KEMET-datasheet-157246123.pdf?src-supplier=Electro+Sonic; ComponentLink11Description: https://datasheet.octopart.com:443/C0603C153J3GACTU-KEMET-datasheet-157246123.pdf?src-supplier=Electro+Sonic; ComponentLink12URL: https://datasheet.octopart.com:443/C0603C153J3GACTU-KEMET-datasheet-176142193.pdf?src-supplier=Newark; ComponentLink12Description: https://datasheet.octopart.com:443/C0603C153J3GACTU-KEMET-datasheet-176142193.pdf?src-supplier=Newark; ComponentLink13URL: https://datasheet.octopart.com:443/C0603C153J3GACTU-KEMET-datasheet-101575703.pdf?src-supplier=Newark; ComponentLink13Description: https://datasheet.octopart.com:443/C0603C153J3GACTU-KEMET-datasheet-101575703.pdf?src-supplier=Newark; ComponentLink14URL: https://datasheet.octopart.com:443/C0603C153J3GACTU-Kemet-datasheet-62307647.pdf?src-supplier=Newark; ComponentLink14Description: https://datasheet.octopart.com:443/C0603C153J3GACTU-Kemet-datasheet-62307647.pdf?src-supplier=Newark; ComponentLink15URL: https://datasheet.octopart.com:443/C0603C153J3GACTU-Kemet-datasheet-67830794.pdf?src-supplier=TME; ComponentLink15Description: https://datasheet.octopart.com:443/C0603C153J3GACTU-Kemet-datasheet-67830794.pdf?src-supplier=TME; ComponentLink16URL: https://datasheet.octopart.com/C0603C153J3GACTU-KEMET-datasheet-84169754.pdf; ComponentLink16Description: https://datasheet.octopart.com/C0603C153J3GACTU-KEMET-datasheet-84169754.pdf; ComponentLink17URL: https://datasheet.octopart.com:443/C0603C153J3GACTU-Kemet-datasheet-60243840.pdf?src-supplier=RS+(Formerly+Allied+Electronics); ComponentLink17Description: https://datasheet.octopart.com:443/C0603C153J3GACTU-Kemet-datasheet-60243840.pdf?src-supplier=RS+(Formerly+Allied+Electronics)
C19 = KGM15ACG1H470JT: 47 pF ±5% 50V Ceramic Capacitor C0G, NP0 0603 (1608 Metric); Manufacturer: KYOCERA AVX; Supplier: DigiKey; Manufacturer Part Number: KGM15ACG1H470JT; RoHS: Compliant; Category: Ceramic Capacitors; Stock: 45031; Pricing: 1=0.1, 10=0.038, 50=0.0258, 100=0.0221, 500=0.0159, 1000=0.014 (USD); Value: 47pF; China RoHS: Compliant; Dielectric Material: Ceramic; Height: 900µm; Length: 1.6mm; Lifecycle Status: Production; Max Operating Temperature: 125°C; Min Operating Temperature: -55°C; Mounting Technology: Surface Mount; Number of Terminals: 2; REACH SVHC: Yes; Voltage Rating (DC): 50V; Width: 810µm; ComponentLink1URL: https://datasheet.octopart.com:443/KGM15ACG1H470JT-KYOCERA-AVX-datasheet-182064292.pdf?src-supplier=IHS; ComponentLink1Description: https://datasheet.octopart.com:443/KGM15ACG1H470JT-KYOCERA-AVX-datasheet-182064292.pdf?src-supplier=IHS; ComponentLink2URL: https://datasheet.octopart.com:443/KGM15ACG1H470JT-KYOCERA-AVX-datasheet-178027269.pdf?src-supplier=TME; ComponentLink2Description: https://datasheet.octopart.com:443/KGM15ACG1H470JT-KYOCERA-AVX-datasheet-178027269.pdf?src-supplier=TME; LCSC PN: C513324
C21 = CGA2B3X7R1H103K050BE: 10000 pF ±10% 50V Ceramic Capacitor X7R 0402 (1005 Metric); Manufacturer: TDK; Manufacturer Lifecycle Status: PRODUCTION; Supplier: DigiKey; Manufacturer Part Number: CGA2B3X7R1H103K050BE; RoHS: Compliant; Category: Ceramic Capacitors; Stock: 148551; Pricing: 1=0.16, 10=0.089, 50=0.0628, 100=0.0548, 500=0.0413, 1000=0.03714, 2500=0.03276, 5000=0.03082, 10000=0.02851, 20000=0.02751, 30000=0.02335, 50000=0.02244, 70000=0.02239 (USD); Value: 10nF; Case/Package: 0402; Case Code (Imperial): 0402; Case Code (Metric): 1005; China RoHS: Compliant; Dielectric Material: Ceramic; Features: Soft Termination; Height: 500µm; Length: 1mm; Lifecycle Status: Production; Material: Ceramic; Max Length: 1.15mm; Max Operating Temperature: 125°C; Max Width: 600µm; Min Length: 950µm; Min Operating Temperature: -55°C; Min Width: 450µm; Mounting Technology: Surface Mount; Number of Terminals: 2; Ratings: AEC-Q200; REACH SVHC: Yes; Schedule B: 8532240020, 8532240020|8532240020, 8532240020|8532240020|8532240020, 8532240020|8532240020|8532240020|8532240020; Thickness: 609.6µm; Tolerance: 10%; Voltage Rating: 50V; Voltage Rating (DC): 50V; Width: 500µm; ComponentLink1URL: https://datasheet.octopart.com:443/CGA2B3X7R1H103K050BE-TDK-datasheet-153441518.pdf?src-supplier=ODG+(Origin+Data+Global); ComponentLink1Description: https://datasheet.octopart.com:443/CGA2B3X7R1H103K050BE-TDK-datasheet-153441518.pdf?src-supplier=ODG+(Origin+Data+Global); ComponentLink2URL: https://datasheet.octopart.com:443/CGA2B3X7R1H103K050BE-TDK-datasheet-57863114.pdf?src-supplier=Upverter; ComponentLink2Description: https://datasheet.octopart.com:443/CGA2B3X7R1H103K050BE-TDK-datasheet-57863114.pdf?src-supplier=Upverter; ComponentLink3URL: https://datasheet.octopart.com:443/CGA2B3X7R1H103K050BE-TDK-datasheet-165583812.pdf?src-supplier=TME; ComponentLink3Description: https://datasheet.octopart.com:443/CGA2B3X7R1H103K050BE-TDK-datasheet-165583812.pdf?src-supplier=TME; ComponentLink4URL: https://datasheet.octopart.com:443/CGA2B3X7R1H103K050BE-TDK-datasheet-41194876.pdf?src-supplier=Future+Electronics; ComponentLink4Description: https://datasheet.octopart.com:443/CGA2B3X7R1H103K050BE-TDK-datasheet-41194876.pdf?src-supplier=Future+Electronics; LCSC PN: C248318
C22 = C0805C181K5GACTU: 180 pF ±10% 50V Ceramic Capacitor C0G, NP0 0805 (2012 Metric); Manufacturer: KEMET; Dissipation Factor: 0.1%; Temperature Coefficient: 30ppm/°C; Supplier: DigiKey; Manufacturer Part Number: C0805C181K5GACTU; RoHS: Compliant; Category: Ceramic Capacitors; Stock: 25815; Pricing: 1=0.23, 10=0.11, 50=0.0658, 100=0.0518, 500=0.04024 (USD); Value: 180pF; Case/Package: 0805; Case Code (Imperial): 0805; Case Code (Metric): 2012; China RoHS: Compliant; Depth: 1.25mm; Dielectric: C0G; Dielectric Material: Ceramic; Height: 780µm; Lead Free: Lead Free; Lead Pitch: 750µm; Length: 2mm; Lifecycle Status: Production; Material: Ceramic; Max Operating Temperature: 125°C; Min Operating Temperature: -55°C; Mounting Technology: Surface Mount; Number of Terminals: 2; Packaging: Cut Tape; Radiation Hardening: No; REACH SVHC: Yes; Schedule B: 8532240020, 8532240020|8532240020|8532240020|8532240020|8532240020; Termination: SMD/SMT; Thickness: 889µm; Tolerance: 10%; Voltage Rating: 50V; Voltage Rating (DC): 50V; Width: 1.25mm; ComponentLink1URL: https://datasheet.octopart.com:443/C0805C181K5GACTU-KEMET-datasheet-178132257.pdf?src-supplier=IHS; ComponentLink1Description: https://datasheet.octopart.com:443/C0805C181K5GACTU-KEMET-datasheet-178132257.pdf?src-supplier=IHS; ComponentLink2URL: https://datasheet.octopart.com:443/C0805C181K5GAC7800-KEMET-datasheet-182041591.pdf?src-supplier=IHS; ComponentLink2Description: https://datasheet.octopart.com:443/C0805C181K5GAC7800-KEMET-datasheet-182041591.pdf?src-supplier=IHS; ComponentLink3URL: https://datasheet.octopart.com:443/C0805C181K5GACTU-KEMET-datasheet-68331921.pdf?src-supplier=Upverter; ComponentLink3Description: https://datasheet.octopart.com:443/C0805C181K5GACTU-KEMET-datasheet-68331921.pdf?src-supplier=Upverter; ComponentLink4URL: https://datasheet.octopart.com:443/C0805C181K5GACTU-KEMET-datasheet-86780271.pdf?src-supplier=Newark; ComponentLink4Description: https://datasheet.octopart.com:443/C0805C181K5GACTU-KEMET-datasheet-86780271.pdf?src-supplier=Newark; ComponentLink5URL: https://datasheet.octopart.com:443/C0805C181K5GACTU-KEMET-datasheet-176289624.pdf?src-supplier=Newark; ComponentLink5Description: https://datasheet.octopart.com:443/C0805C181K5GACTU-KEMET-datasheet-176289624.pdf?src-supplier=Newark; ComponentLink6URL: https://datasheet.octopart.com:443/C0805C181K5GACTU-Kemet-datasheet-27203262.pdf?src-supplier=Newark; ComponentLink6Description: https://datasheet.octopart.com:443/C0805C181K5GACTU-Kemet-datasheet-27203262.pdf?src-supplier=Newark; ComponentLink7URL: https://datasheet.octopart.com:443/C0805C181K5GACTU-Kemet-datasheet-10540709.pdf?src-supplier=Newark; ComponentLink7Description: https://datasheet.octopart.com:443/C0805C181K5GACTU-Kemet-datasheet-10540709.pdf?src-supplier=Newark; ComponentLink8URL: https://datasheet.octopart.com:443/C0805C181K5GACTU-KEMET-datasheet-86453355.pdf?src-supplier=Farnell; ComponentLink8Description: https://datasheet.octopart.com:443/C0805C181K5GACTU-KEMET-datasheet-86453355.pdf?src-supplier=Farnell; ComponentLink9URL: https://datasheet.octopart.com:443/C0805C181K5GACTU-KEMET-datasheet-149533543.pdf?src-supplier=Farnell; ComponentLink9Description: https://datasheet.octopart.com:443/C0805C181K5GACTU-KEMET-datasheet-149533543.pdf?src-supplier=Farnell; ComponentLink10URL: https://datasheet.octopart.com:443/C0805C181K5GACTU-KEMET-datasheet-68494377.pdf?src-supplier=element14+APAC; ComponentLink10Description: https://datasheet.octopart.com:443/C0805C181K5GACTU-KEMET-datasheet-68494377.pdf?src-supplier=element14+APAC; ComponentLink11URL: https://datasheet.octopart.com:443/C0805C181K5GACTU-KEMET-datasheet-37178240.pdf?src-supplier=Electro+Sonic; ComponentLink11Description: https://datasheet.octopart.com:443/C0805C181K5GACTU-KEMET-datasheet-37178240.pdf?src-supplier=Electro+Sonic; ComponentLink12URL: https://datasheet.octopart.com/C0805C181K5GACTU-KEMET-datasheet-84169754.pdf; ComponentLink12Description: https://datasheet.octopart.com/C0805C181K5GACTU-KEMET-datasheet-84169754.pdf; LCSC PN: C2168955
C23 = CL10C121JB8NNNC: 120 pF ±5% 50V Ceramic Capacitor C0G, NP0 0603 (1608 Metric); Manufacturer: Samsung Electro-Mechanics; Temperature Coefficient: 30ppm/°C; Supplier: DigiKey; Manufacturer Part Number: CL10C121JB8NNNC; RoHS: Compliant; Category: Ceramic Capacitors; Stock: 128945; Pricing: 1=0.1, 10=0.033, 50=0.0222, 100=0.019, 500=0.01358, 1000=0.01191, 4000=0.00553, 8000=0.00548, 12000=0.00544, 20000=0.00539, 28000=0.00536, 40000=0.00534, 48000=0.00532, 96000=0.00528, 100000=0.00528 (USD); Value: 120pF; Case/Package: 0603; Case Code (Imperial): 0603; Case Code (Metric): 1608; China RoHS: Compliant; Contact Plating: Tin; Depth: 800µm; Dielectric: C0G; Dielectric Material: Ceramic; Height: 900µm; Length: 1.6mm; Lifecycle Status: Production; Material: Ceramic; Max Operating Temperature: 125°C; Min Operating Temperature: -55°C; Mounting Technology: Surface Mount; Number of Terminals: 2; Radiation Hardening: No; REACH SVHC: Yes; Schedule B: 8532240020, 8532240020|8532240020, 8532240020|8532240020|8532240020, 8532240020|8532240020|8532240020|8532240020; Thickness: 889µm; Tolerance: 5%; Voltage: 50V; Voltage Rating: 50V; Voltage Rating (DC): 50V; Width: 800µm; ComponentLink1URL: https://datasheet.octopart.com:443/CL10C121JB8NNNC-Samsung-Electro-Mechanics-datasheet-136482399.pdf?src-supplier=IHS; ComponentLink1Description: https://datasheet.octopart.com:443/CL10C121JB8NNNC-Samsung-Electro-Mechanics-datasheet-136482399.pdf?src-supplier=IHS; ComponentLink2URL: https://datasheet.octopart.com/CL10C121JB8NNNC-Samsung-Electro-Mechanics-datasheet-8324245.pdf; ComponentLink2Description: https://datasheet.octopart.com/CL10C121JB8NNNC-Samsung-Electro-Mechanics-datasheet-8324245.pdf; ComponentLink3URL: https://datasheet.octopart.com/CL10C121JB8NNNC-Samsung-Electro-Mechanics-datasheet-97040617.pdf; ComponentLink3Description: https://datasheet.octopart.com/CL10C121JB8NNNC-Samsung-Electro-Mechanics-datasheet-97040617.pdf; ComponentLink4URL: https://datasheet.octopart.com/General-Multilayer-Ceramic-Capacitors-Samsung-datasheet-family-111.pdf; ComponentLink4Description: https://datasheet.octopart.com/General-Multilayer-Ceramic-Capacitors-Samsung-datasheet-family-111.pdf; ComponentLink5URL: https://datasheet.octopart.com:443/CL10C121JB8NNNC-Samsung-Electro-Mechanics-datasheet-110226337.pdf?src-supplier=Future+Electronics; ComponentLink5Description: https://datasheet.octopart.com:443/CL10C121JB8NNNC-Samsung-Electro-Mechanics-datasheet-110226337.pdf?src-supplier=Future+Electronics; ComponentLink6URL: https://datasheet.octopart.com:443/CL10C121JB8NNNC-Samsung-Electro-Mechanics-datasheet-81461980.pdf?src-supplier=Future+Electronics; ComponentLink6Description: https://datasheet.octopart.com:443/CL10C121JB8NNNC-Samsung-Electro-Mechanics-datasheet-81461980.pdf?src-supplier=Future+Electronics; ComponentLink7URL: https://datasheet.octopart.com:443/CL10C121JB8NNNC-Samsung-datasheet-42280544.pdf?src-supplier=Future+Electronics; ComponentLink7Description: https://datasheet.octopart.com:443/CL10C121JB8NNNC-Samsung-datasheet-42280544.pdf?src-supplier=Future+Electronics; ComponentLink8URL: https://datasheet.octopart.com:443/CL10C121JB8NNNC-Samsung-datasheet-26669124.pdf?src-supplier=Future+Electronics; ComponentLink8Description: https://datasheet.octopart.com:443/CL10C121JB8NNNC-Samsung-datasheet-26669124.pdf?src-supplier=Future+Electronics; ComponentLink9URL: https://datasheet.octopart.com:443/CL10C121JB8NNNC-Samsung-Electro-Mechanics-datasheet-149154142.pdf?src-supplier=Future+Electronics; ComponentLink9Description: https://datasheet.octopart.com:443/CL10C121JB8NNNC-Samsung-Electro-Mechanics-datasheet-149154142.pdf?src-supplier=Future+Electronics; ComponentLink10URL: https://datasheet.octopart.com:443/CL10C121JB8NNNC-Samsung-datasheet-8326407.pdf?src-supplier=TME; ComponentLink10Description: https://datasheet.octopart.com:443/CL10C121JB8NNNC-Samsung-datasheet-8326407.pdf?src-supplier=TME; ComponentLink11URL: https://datasheet.octopart.com:443/CL10C121JB8NNNC-Samsung-Electro-Mechanics-datasheet-11541288.pdf?src-supplier=Arrow+Electronics; ComponentLink11Description: https://datasheet.octopart.com:443/CL10C121JB8NNNC-Samsung-Electro-Mechanics-datasheet-11541288.pdf?src-supplier=Arrow+Electronics; ComponentLink12URL: http://sigma.octopart.com:80/rohs_certificate/General-Multilayer-Ceramic-Capacitors-Samsung-family-110.pdf?src-supplier=Compliance+Statements; ComponentLink12Description: http://sigma.octopart.com:80/rohs_certificate/General-Multilayer-Ceramic-Capacitors-Samsung-family-110.pdf?src-supplier=Compliance+Statements; ComponentLink13URL: http://sigma.octopart.com:80/rohs_statement/General-Multilayer-Ceramic-Capacitors-Samsung-family-132.pdf?src-supplier=Compliance+Statements; ComponentLink13Description: http://sigma.octopart.com:80/rohs_statement/General-Multilayer-Ceramic-Capacitors-Samsung-family-132.pdf?src-supplier=Compliance+Statements; ComponentLink14URL: http://sigma.octopart.com:80/reach_statement/General-Multilayer-Ceramic-Capacitors-Samsung-family-133.pdf?src-supplier=Compliance+Statements; ComponentLink14Description: http://sigma.octopart.com:80/reach_statement/General-Multilayer-Ceramic-Capacitors-Samsung-family-133.pdf?src-supplier=Compliance+Statements; LCSC PN: C18438
C24 = EEEFP1C101AV: 100 µF 16 V Aluminum Electrolytic Capacitors Radial, Can - SMD 260mOhm @ 100kHz 2000 Hrs @ 105°C; Manufacturer: Panasonic; Value: 100µF; ESR (Equivalent Series Resistance): 260mΩ; Leakage Current: 16µA; Ripple Current: 195mA; Supplier: DigiKey; Manufacturer Part Number: EEEFP1C101AV; RoHS: Compliant; Category: Aluminum Electrolytic Capacitors; Pricing: 1=1.22, 10=0.78, 50=0.5968, 100=0.5387, 500=0.43876, 1000=0.41502, 2000=0.38836, 3000=0.37491, 5000=0.35991, 7000=0.3511, 10000=0.34259, 12000=0.33854, 24000=0.32485, 25000=0.32412 (USD); Diameter: 6.3mm; Height: 6.1mm; Length: 6.6mm; Lifecycle Status: Production; Max Operating Temperature: 105°C; Min Operating Temperature: -55°C; Mounting Technology: Surface Mount; Number of Terminals: 2; REACH SVHC: Yes; Voltage Rating (DC): 16V; Width: 6.6mm; ComponentLink1URL: https://datasheet.octopart.com:443/EEEFP1C101AV-Panasonic-datasheet-182100943.pdf?src-supplier=IHS; ComponentLink1Description: https://datasheet.octopart.com:443/EEEFP1C101AV-Panasonic-datasheet-182100943.pdf?src-supplier=IHS; ComponentLink2URL: https://datasheet.octopart.com:443/EEEFP1C101AV-Panasonic-datasheet-66433925.pdf?src-supplier=TME; ComponentLink2Description: https://datasheet.octopart.com:443/EEEFP1C101AV-Panasonic-datasheet-66433925.pdf?src-supplier=TME; ComponentLink3URL: https://datasheet.octopart.com:443/EEE-FP1C101AV-Panasonic-datasheet-136348056.pdf?src-supplier=Electro+Sonic; ComponentLink3Description: https://datasheet.octopart.com:443/EEE-FP1C101AV-Panasonic-datasheet-136348056.pdf?src-supplier=Electro+Sonic; ComponentLink4URL: https://datasheet.octopart.com:443/EEE-FP1C101AV-Panasonic-datasheet-136612397.pdf?src-supplier=Electro+Sonic; ComponentLink4Description: https://datasheet.octopart.com:443/EEE-FP1C101AV-Panasonic-datasheet-136612397.pdf?src-supplier=Electro+Sonic; ComponentLink5URL: https://sigma.octopart.com:443/150570760/technical_drawing/Panasonic-EEEFP1C101AV.pdf?src-supplier=Panasonic+SCT; ComponentLink5Description: https://sigma.octopart.com:443/150570760/technical_drawing/Panasonic-EEEFP1C101AV.pdf?src-supplier=Panasonic+SCT; LCSC PN: C3829571
C26 = EEE-FP0J102AL: 1000 µF 6.3 V Aluminum Electrolytic Capacitors Radial, Can - SMD 80mOhm @ 100kHz 2000 Hrs @ 105°C; Manufacturer: Panasonic; Value: 1mF; ESR (Equivalent Series Resistance): 80mΩ; Leakage Current: 63µA; Ripple Current: 595mA; Supplier: DigiKey; Manufacturer Part Number: EEE-FP0J102AL; RoHS: Compliant; Category: Aluminum Electrolytic Capacitors; Stock: 2934; Pricing: 1=1.12, 10=0.713, 50=0.5436, 100=0.4899, 500=0.40504, 1000=0.37537, 1500=0.36039, 2500=0.34368, 3500=0.33387, 5000=0.32438, 6000=0.31988, 12000=0.30461, 12500=0.3038 (USD); Diameter: 8mm; Height: 10.2mm; Length: 8.3mm; Lifecycle Status: Production; Max Operating Temperature: 105°C; Min Operating Temperature: -55°C; Mounting Technology: Surface Mount; Number of Terminals: 2; REACH SVHC: Yes; Schedule B: 8532220020, 8532220020|8532220020|8532220020|8532220020|8532220020|8532220020|8532220020|8532220020|8532220020|8532220020|8532220020|8532220020|8532220020|8532220020|8532220020|8532220020|8532220020|8532220020|8532220020|8532220020|8532220020|8532220020|8532220020|85; Voltage Rating (DC): 6.3V; Width: 8.3mm; ComponentLink1URL: https://datasheet.octopart.com:443/EEEFP0J102AL-Panasonic-datasheet-166314007.pdf?src-supplier=Farnell; ComponentLink1Description: https://datasheet.octopart.com:443/EEEFP0J102AL-Panasonic-datasheet-166314007.pdf?src-supplier=Farnell; ComponentLink2URL: https://datasheet.octopart.com:443/EEE-FP0J102AL-Panasonic-datasheet-147569660.pdf?src-supplier=Electro+Sonic; ComponentLink2Description: https://datasheet.octopart.com:443/EEE-FP0J102AL-Panasonic-datasheet-147569660.pdf?src-supplier=Electro+Sonic; ComponentLink3URL: https://datasheet.octopart.com:443/EEEFP0J102AL-Panasonic-datasheet-150570767.pdf?src-supplier=Panasonic+SCT; ComponentLink3Description: https://datasheet.octopart.com:443/EEEFP0J102AL-Panasonic-datasheet-150570767.pdf?src-supplier=Panasonic+SCT; ComponentLink4URL: https://sigma.octopart.com:443/150570760/technical_drawing/Panasonic-EEEFP0J102AL.pdf?src-supplier=Panasonic+SCT; ComponentLink4Description: https://sigma.octopart.com:443/150570760/technical_drawing/Panasonic-EEEFP0J102AL.pdf?src-supplier=Panasonic+SCT; LCSC PN: C1881616